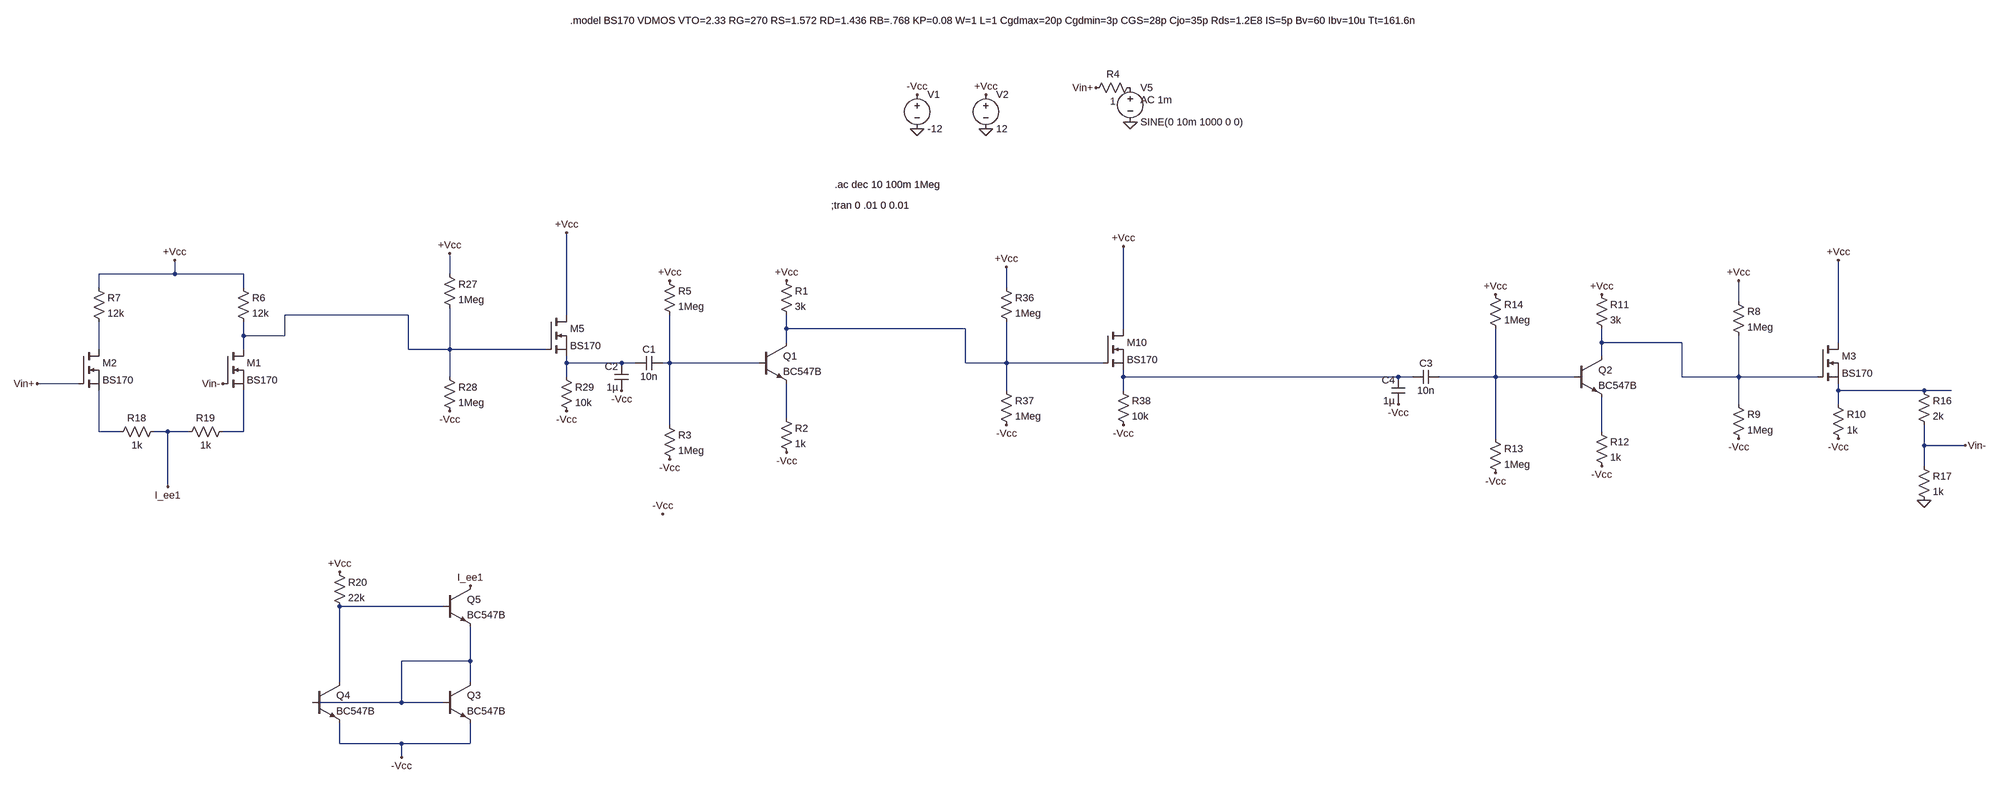
[diagram p0: schematic testing.asc]
testing.asc, the LTspice schematic file:
Version 4
SHEET 1 4084 732
WIRE -2544 -1392 -2544 -1424
WIRE -2544 -1392 -2720 -1392
WIRE -2384 -1392 -2544 -1392
WIRE -1904 -1392 -1904 -1440
WIRE -2720 -1360 -2720 -1392
WIRE -2384 -1360 -2384 -1392
WIRE -608 -1360 -608 -1408
WIRE 1376 -1328 1376 -1376
WIRE -2000 -1296 -2288 -1296
WIRE -1632 -1296 -1632 -1488
WIRE -1120 -1264 -1120 -1296
WIRE -704 -1264 -1120 -1264
WIRE -336 -1264 -336 -1456
WIRE -2384 -1248 -2384 -1280
WIRE -2288 -1248 -2288 -1296
WIRE -2288 -1248 -2384 -1248
WIRE -1120 -1232 -1120 -1264
WIRE 864 -1232 864 -1264
WIRE 1184 -1232 864 -1232
WIRE 1648 -1232 1648 -1424
WIRE -2720 -1216 -2720 -1280
WIRE -2384 -1216 -2384 -1248
WIRE -2000 -1216 -2000 -1296
WIRE -1904 -1216 -1904 -1312
WIRE -1904 -1216 -2000 -1216
WIRE -1680 -1216 -1904 -1216
WIRE 864 -1200 864 -1232
WIRE -1632 -1184 -1632 -1200
WIRE -1504 -1184 -1632 -1184
WIRE -1472 -1184 -1504 -1184
WIRE -1392 -1184 -1392 -1296
WIRE -1392 -1184 -1408 -1184
WIRE -1184 -1184 -1392 -1184
WIRE -704 -1184 -704 -1264
WIRE -608 -1184 -608 -1280
WIRE -608 -1184 -704 -1184
WIRE -384 -1184 -608 -1184
WIRE -1904 -1152 -1904 -1216
WIRE -1632 -1152 -1632 -1184
WIRE -336 -1152 -336 -1168
WIRE 304 -1152 -336 -1152
WIRE 336 -1152 304 -1152
WIRE 592 -1152 592 -1264
WIRE 592 -1152 400 -1152
WIRE 800 -1152 592 -1152
WIRE 1184 -1152 1184 -1232
WIRE 1376 -1152 1376 -1248
WIRE 1376 -1152 1184 -1152
WIRE 1600 -1152 1376 -1152
WIRE -2768 -1136 -2864 -1136
WIRE -608 -1120 -608 -1184
WIRE -336 -1120 -336 -1152
WIRE 1648 -1120 1648 -1136
WIRE 1856 -1120 1648 -1120
WIRE 1920 -1120 1856 -1120
WIRE 1376 -1088 1376 -1152
WIRE 1648 -1088 1648 -1120
WIRE -1120 -1056 -1120 -1136
WIRE -1392 -1040 -1392 -1184
WIRE -2720 -1024 -2720 -1120
WIRE -2672 -1024 -2720 -1024
WIRE -2560 -1024 -2592 -1024
WIRE -2512 -1024 -2560 -1024
WIRE -2384 -1024 -2384 -1120
WIRE -2384 -1024 -2432 -1024
WIRE 864 -1024 864 -1104
WIRE 592 -1008 592 -1152
WIRE 1856 -992 1856 -1040
WIRE 1952 -992 1856 -992
WIRE 1856 -944 1856 -992
WIRE -2560 -896 -2560 -1024
WIRE -1920 -432 -2160 -432
WIRE -1856 -304 -1856 -384
WIRE -1856 -304 -2016 -304
WIRE -2160 -256 -2160 -432
WIRE -1856 -256 -1856 -304
WIRE -2016 -208 -2016 -304
WIRE -2016 -208 -2224 -208
WIRE -1920 -208 -2016 -208
WIRE -2160 -112 -2160 -160
WIRE -2016 -112 -2160 -112
WIRE -1856 -112 -1856 -160
WIRE -1856 -112 -2016 -112
WIRE -2016 -80 -2016 -112
FLAG -816 -1760 0
FLAG -656 -1760 0
FLAG -816 -1840 -Vcc
FLAG -656 -1840 +Vcc
FLAG -320 -1776 0
FLAG -400 -1856 Vin+
FLAG -608 -1408 +Vcc
FLAG -336 -1456 +Vcc
FLAG -1392 -1376 +Vcc
FLAG -1120 -1376 +Vcc
FLAG -2544 -1424 +Vcc
FLAG 1376 -1376 +Vcc
FLAG 1648 -1424 +Vcc
FLAG 592 -1344 +Vcc
FLAG 864 -1344 +Vcc
FLAG -2864 -1136 Vin+
FLAG 1952 -992 Vin-
FLAG -2016 -80 -Vcc
FLAG -2160 -512 +Vcc
FLAG -1856 -480 I_ee1
FLAG -2560 -896 I_ee1
FLAG -1408 -832 -Vcc
FLAG -1392 -960 -Vcc
FLAG -1120 -976 -Vcc
FLAG -608 -1040 -Vcc
FLAG -336 -1040 -Vcc
FLAG 592 -928 -Vcc
FLAG 864 -944 -Vcc
FLAG 1376 -1008 -Vcc
FLAG 1648 -1008 -Vcc
FLAG 1856 -864 0
FLAG -2432 -1136 Vin-
FLAG -1904 -1440 +Vcc
FLAG -1632 -1488 +Vcc
FLAG -1904 -1072 -Vcc
FLAG -1632 -1072 -Vcc
FLAG -1504 -1120 -Vcc
FLAG 304 -1088 -Vcc
SYMBOL voltage -816 -1856 R0
WINDOW 123 0 0 Left 0
WINDOW 39 0 0 Left 0
SYMATTR InstName V1
SYMATTR Value -12
SYMBOL voltage -656 -1856 R0
WINDOW 123 0 0 Left 0
WINDOW 39 0 0 Left 0
SYMATTR InstName V2
SYMATTR Value 12
SYMBOL voltage -320 -1872 R0
WINDOW 123 24 44 Left 2
WINDOW 39 0 0 Left 0
SYMATTR Value2 AC 1m
SYMATTR InstName V5
SYMATTR Value SINE(0 10m 1000 0 0)
SYMBOL res -304 -1872 R90
WINDOW 0 0 56 VBottom 2
WINDOW 3 32 56 VTop 2
SYMATTR InstName R4
SYMATTR Value 1
SYMBOL nmos -384 -1264 R0
SYMATTR InstName M10
SYMATTR Value BS170
SYMBOL res -624 -1376 R0
SYMATTR InstName R36
SYMATTR Value 1Meg
SYMBOL res -624 -1136 R0
SYMATTR InstName R37
SYMATTR Value 1Meg
SYMBOL res -352 -1136 R0
SYMATTR InstName R38
SYMATTR Value 10k
SYMBOL npn -1184 -1232 R0
SYMATTR InstName Q1
SYMATTR Value BC547B
SYMBOL res -1136 -1392 R0
SYMATTR InstName R1
SYMATTR Value 3k
SYMBOL res -1136 -1072 R0
SYMATTR InstName R2
SYMATTR Value 1k
SYMBOL res -1408 -1056 R0
SYMATTR InstName R3
SYMATTR Value 1Meg
SYMBOL res -1408 -1392 R0
SYMATTR InstName R5
SYMATTR Value 1Meg
SYMBOL nmos -2768 -1216 R0
SYMATTR InstName M2
SYMATTR Value BS170
SYMBOL res -2400 -1376 R0
SYMATTR InstName R6
SYMATTR Value 12k
SYMBOL res -2736 -1376 R0
SYMATTR InstName R7
SYMATTR Value 12k
SYMBOL nmos -2432 -1216 R0
SYMATTR InstName M1
SYMATTR Value BS170
SYMBOL nmos 1600 -1232 R0
SYMATTR InstName M3
SYMATTR Value BS170
SYMBOL res 1360 -1344 R0
SYMATTR InstName R8
SYMATTR Value 1Meg
SYMBOL res 1360 -1104 R0
SYMATTR InstName R9
SYMATTR Value 1Meg
SYMBOL res 1632 -1104 R0
SYMATTR InstName R10
SYMATTR Value 1k
SYMBOL npn 800 -1200 R0
SYMATTR InstName Q2
SYMATTR Value BC547B
SYMBOL res 848 -1360 R0
SYMATTR InstName R11
SYMATTR Value 3k
SYMBOL res 848 -1040 R0
SYMATTR InstName R12
SYMATTR Value 1k
SYMBOL res 576 -1024 R0
SYMATTR InstName R13
SYMATTR Value 1Meg
SYMBOL res 576 -1360 R0
SYMATTR InstName R14
SYMATTR Value 1Meg
SYMBOL res 1840 -1136 R0
SYMATTR InstName R16
SYMATTR Value 2k
SYMBOL res 1840 -960 R0
SYMATTR InstName R17
SYMATTR Value 1k
SYMBOL res -2576 -1040 R90
WINDOW 0 0 56 VBottom 2
WINDOW 3 32 56 VTop 2
SYMATTR InstName R18
SYMATTR Value 1k
SYMBOL res -2416 -1040 R90
WINDOW 0 0 56 VBottom 2
WINDOW 3 32 56 VTop 2
SYMATTR InstName R19
SYMATTR Value 1k
SYMBOL npn -1920 -256 R0
SYMATTR InstName Q3
SYMATTR Value BC547B
SYMBOL npn -2224 -256 R0
SYMATTR InstName Q4
SYMATTR Value BC547B
SYMBOL npn -1920 -480 R0
SYMATTR InstName Q5
SYMATTR Value BC547B
SYMBOL res -2176 -528 R0
SYMATTR InstName R20
SYMATTR Value 22k
SYMBOL nmos -1680 -1296 R0
SYMATTR InstName M5
SYMATTR Value BS170
SYMBOL res -1920 -1408 R0
SYMATTR InstName R27
SYMATTR Value 1Meg
SYMBOL res -1920 -1168 R0
SYMATTR InstName R28
SYMATTR Value 1Meg
SYMBOL res -1648 -1168 R0
SYMATTR InstName R29
SYMATTR Value 10k
SYMBOL cap -1408 -1200 R90
WINDOW 0 0 32 VBottom 2
WINDOW 3 32 32 VTop 2
SYMATTR InstName C1
SYMATTR Value 10n
SYMBOL cap -1488 -1120 R180
WINDOW 0 24 56 Left 2
WINDOW 3 24 8 Left 2
SYMATTR InstName C2
SYMATTR Value 1µ
SYMBOL cap 400 -1168 R90
WINDOW 0 0 32 VBottom 2
WINDOW 3 32 32 VTop 2
SYMATTR InstName C3
SYMATTR Value 10n
SYMBOL cap 320 -1088 R180
WINDOW 0 24 56 Left 2
WINDOW 3 24 8 Left 2
SYMATTR InstName C4
SYMATTR Value 1µ
TEXT -1016 -1552 Left 2 !;tran 0 .01 0 0.01
TEXT -1624 -2048 Left 2 !.model BS170 VDMOS VTO=2.33 RG=270 RS=1.572 RD=1.436 RB=.768 KP=0.08 W=1 L=1 Cgdmax=20p Cgdmin=3p CGS=28p Cjo=35p Rds=1.2E8 IS=5p Bv=60 Ibv=10u Tt=161.6n
TEXT -1008 -1600 Left 2 !.ac dec 10 100m 1Meg

The netlist it stands for:
* testing.asc
V1 -Vcc 0 -12
V2 +Vcc 0 12
V5 P001 0 SINE(0 10m 1000 0 0) AC 1m
R4 P001 Vin+ 1
M10 +Vcc N002 N007 N007 BS170
R36 +Vcc N002 1Meg
R37 N002 -Vcc 1Meg
R38 N007 -Vcc 10k
Q1 N002 N006 N010 0 BC547B
R1 +Vcc N002 3k
R2 N010 -Vcc 1k
R3 N006 -Vcc 1Meg
R5 +Vcc N006 1Meg
M2 N004 Vin+ N011 N011 BS170
R6 +Vcc N001 12k
R7 +Vcc N004 12k
M1 N001 Vin- N012 N012 BS170
M3 +Vcc N003 N009 N009 BS170
R8 +Vcc N003 1Meg
R9 N003 -Vcc 1Meg
R10 N009 -Vcc 1k
Q2 N003 N008 N013 0 BC547B
R11 +Vcc N003 3k
R12 N013 -Vcc 1k
R13 N008 -Vcc 1Meg
R14 +Vcc N008 1Meg
R16 N009 Vin- 2k
R17 Vin- 0 1k
R18 I_ee1 N011 1k
R19 N012 I_ee1 1k
Q3 N015 N015 -Vcc 0 BC547B
Q4 N014 N015 -Vcc 0 BC547B
Q5 I_ee1 N014 N015 0 BC547B
R20 +Vcc N014 22k
M5 +Vcc N001 N005 N005 BS170
R27 +Vcc N001 1Meg
R28 N001 -Vcc 1Meg
R29 N005 -Vcc 10k
C1 N006 N005 10n
C2 -Vcc N005 1µ
C3 N008 N007 10n
C4 -Vcc N007 1µ
.model NPN NPN
.model PNP PNP
.lib standard.bjt
.model NMOS NMOS
.model PMOS PMOS
.lib standard.mos
;tran 0 .01 0 0.01
.model BS170 VDMOS VTO=2.33 RG=270 RS=1.572 RD=1.436 RB=.768 KP=0.08 W=1 L=1 Cgdmax=20p Cgdmin=3p CGS=28p Cjo=35p Rds=1.2E8 IS=5p Bv=60 Ibv=10u Tt=161.6n
.ac dec 10 100m 1Meg
.backanno
.end